# Altium schematic sheet Loadcells.SchDoc
size A4
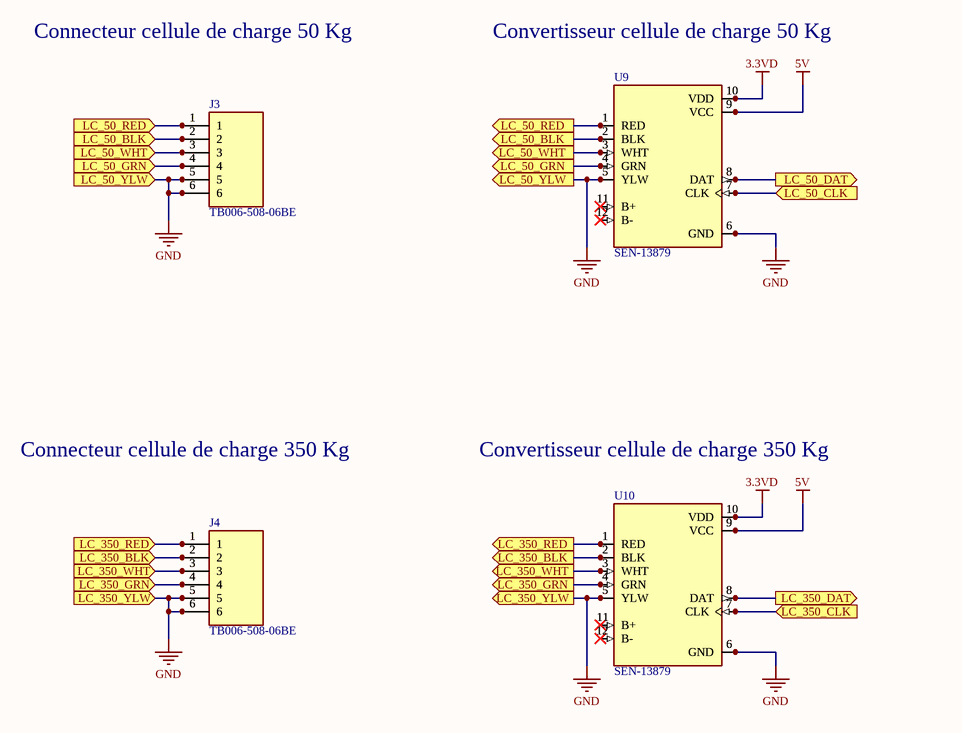
[diagram p0: Loadcells.SchDoc]

## Parts
J3  TB006-508-06BE  [TB006-508-06BE]
J4  TB006-508-06BE  [TB006-508-06BE]
U9  SEN-13879  [SPARKFUN_SEN-13879]
U10  SEN-13879  [SPARKFUN_SEN-13879]

## Ports
LC_50_BLK (in), LC_50_BLK (out), LC_50_CLK (in), LC_50_DAT (out), LC_50_GRN (in), LC_50_GRN (out), LC_50_RED (in), LC_50_RED (out), LC_50_WHT (in), LC_50_WHT (out), LC_50_YLW (in), LC_50_YLW (out), LC_350_BLK (in), LC_350_BLK (out), LC_350_CLK (in), LC_350_DAT (out), LC_350_GRN (in), LC_350_GRN (out), LC_350_RED (in), LC_350_RED (out), LC_350_WHT (in), LC_350_WHT (out), LC_350_YLW (in), LC_350_YLW (out)

## Nets
3.3VD: U9.10(VDD) U10.10(VDD)
5V: U9.9(VCC) U10.9(VCC)
GND: J3.5 J3.6 J4.5 J4.6 U9.5(YLW) U9.6(GND) U10.5(YLW) U10.6(GND) ; port LC_50_YLW, port LC_350_YLW
LC_50_BLK: J3.2 U9.2(BLK) ; port LC_50_BLK
LC_50_CLK: U9.7(CLK) ; port LC_50_CLK
LC_50_DAT: U9.8(DAT) ; port LC_50_DAT
LC_50_GRN: J3.4 U9.4(GRN) ; port LC_50_GRN
LC_50_RED: J3.1 U9.1(RED) ; port LC_50_RED
LC_50_WHT: J3.3 U9.3(WHT) ; port LC_50_WHT
LC_350_BLK: J4.2 U10.2(BLK) ; port LC_350_BLK
LC_350_CLK: U10.7(CLK) ; port LC_350_CLK
LC_350_DAT: U10.8(DAT) ; port LC_350_DAT
LC_350_GRN: J4.4 U10.4(GRN) ; port LC_350_GRN
LC_350_RED: J4.1 U10.1(RED) ; port LC_350_RED
LC_350_WHT: J4.3 U10.3(WHT) ; port LC_350_WHT

Not connected (* = marked no-connect by the designer): U9 11(B+)* 12(B-)*; U10 11(B+)* 12(B-)*

## Notes on the sheet
- Connecteur cellule de charge 50 Kg
- Convertisseur cellule de charge 50 Kg
- Connecteur cellule de charge 350 Kg
- Convertisseur cellule de charge 350 Kg

## Library data of the parts
J3 J4 = TB006-508-06BE: TERMINAL BLOCK, SCREW TYPE, 5.08
U9 U10 = SEN-13879: External Input Sensor Amplifier; MF: SparkFun; MP: SEN-13879; Package: None; Price: None; Availability: Unavailable; Value: *; SnapEDA_Link: https://www.snapeda.com/parts/SEN-13879/SparkFun%20Electronics/view-part/563337/?ref=snap